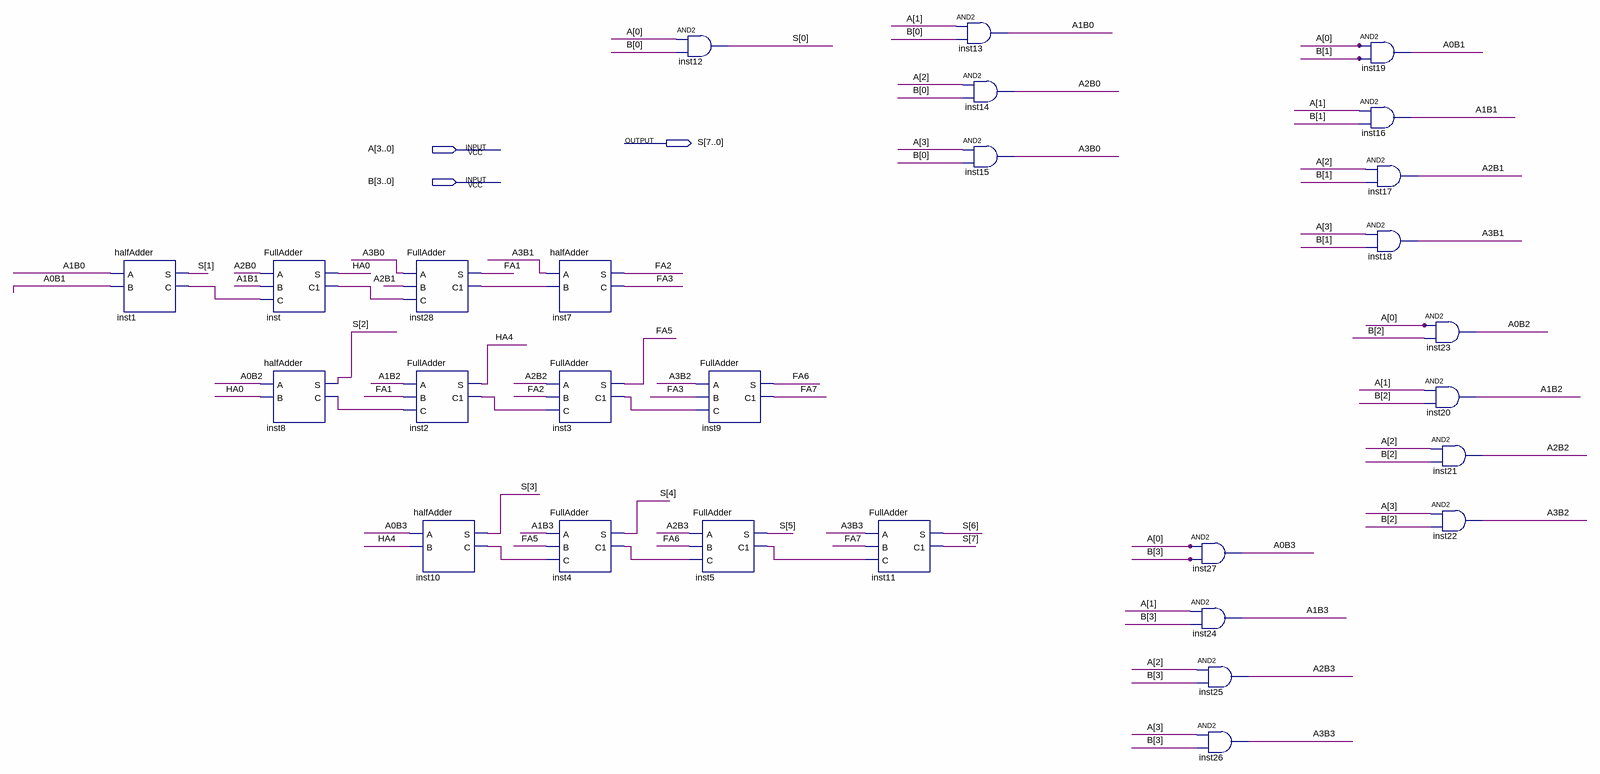
[diagram p0: schematic sheet]
// Quartus schematic multiplier.bdf as structural Verilog: 28 symbols, 3 pins
module multiplier (
  input  [3:0] A,
  input  [3:0] B,
  output [7:0] S
);

  wire A0B1, A0B2, A0B3, A1B0, A1B1, A1B2, A1B3, A2B0, A2B1, A2B2, A2B3, A3B0, A3B1, A3B2, A3B3, FA1, FA2,
       FA3, FA5, FA6, FA7, HA0, HA4, inst1_c, inst2_c1, inst3_c1, inst4_c1, inst5_c1, inst8_c, inst10_c,
       inst28_c1, inst_c1;

  halfAdder inst1 (.A(A1B0), .B(A0B1), .S(S[1]), .C(inst1_c));
  FullAdder inst (.A(A2B0), .B(A1B1), .C(inst1_c), .S(HA0), .C1(inst_c1));
  halfAdder inst8 (.A(A0B2), .B(HA0), .S(S[2]), .C(inst8_c));
  FullAdder inst28 (.A(A3B0), .B(A2B1), .C(inst_c1), .S(FA1), .C1(inst28_c1));
  FullAdder inst2 (.A(A1B2), .B(FA1), .C(inst8_c), .S(HA4), .C1(inst2_c1));
  halfAdder inst10 (.A(A0B3), .B(HA4), .S(S[3]), .C(inst10_c));
  halfAdder inst7 (.A(A3B1), .B(inst28_c1), .S(FA2), .C(FA3));
  FullAdder inst3 (.A(A2B2), .B(FA2), .C(inst2_c1), .S(FA5), .C1(inst3_c1));
  FullAdder inst4 (.A(A1B3), .B(FA5), .C(inst10_c), .S(S[4]), .C1(inst4_c1));
  and inst12 (S[0], A[0], B[0]);
  FullAdder inst9 (.A(A3B2), .B(FA3), .C(inst3_c1), .S(FA6), .C1(FA7));
  FullAdder inst5 (.A(A2B3), .B(FA6), .C(inst4_c1), .S(S[5]), .C1(inst5_c1));
  FullAdder inst11 (.A(A3B3), .B(FA7), .C(inst5_c1), .S(S[6]), .C1(S[7]));
  and inst13 (A1B0, A[1], B[0]);
  and inst14 (A2B0, A[2], B[0]);
  and inst15 (A3B0, A[3], B[0]);
  and inst27 (A0B3, A[0], B[3]);
  and inst24 (A1B3, A[1], B[3]);
  and inst25 (A2B3, A[2], B[3]);
  and inst26 (A3B3, A[3], B[3]);
  and inst19 (A0B1, A[0], B[1]);
  and inst16 (A1B1, A[1], B[1]);
  and inst17 (A2B1, A[2], B[1]);
  and inst18 (A3B1, A[3], B[1]);
  and inst23 (A0B2, A[0], B[2]);
  and inst20 (A1B2, A[1], B[2]);
  and inst21 (A2B2, A[2], B[2]);
  and inst22 (A3B2, A[3], B[2]);
endmodule
